# EAGLE design emonDCduo-ESP+RF v0.3 (EAGLE 7.7.0)
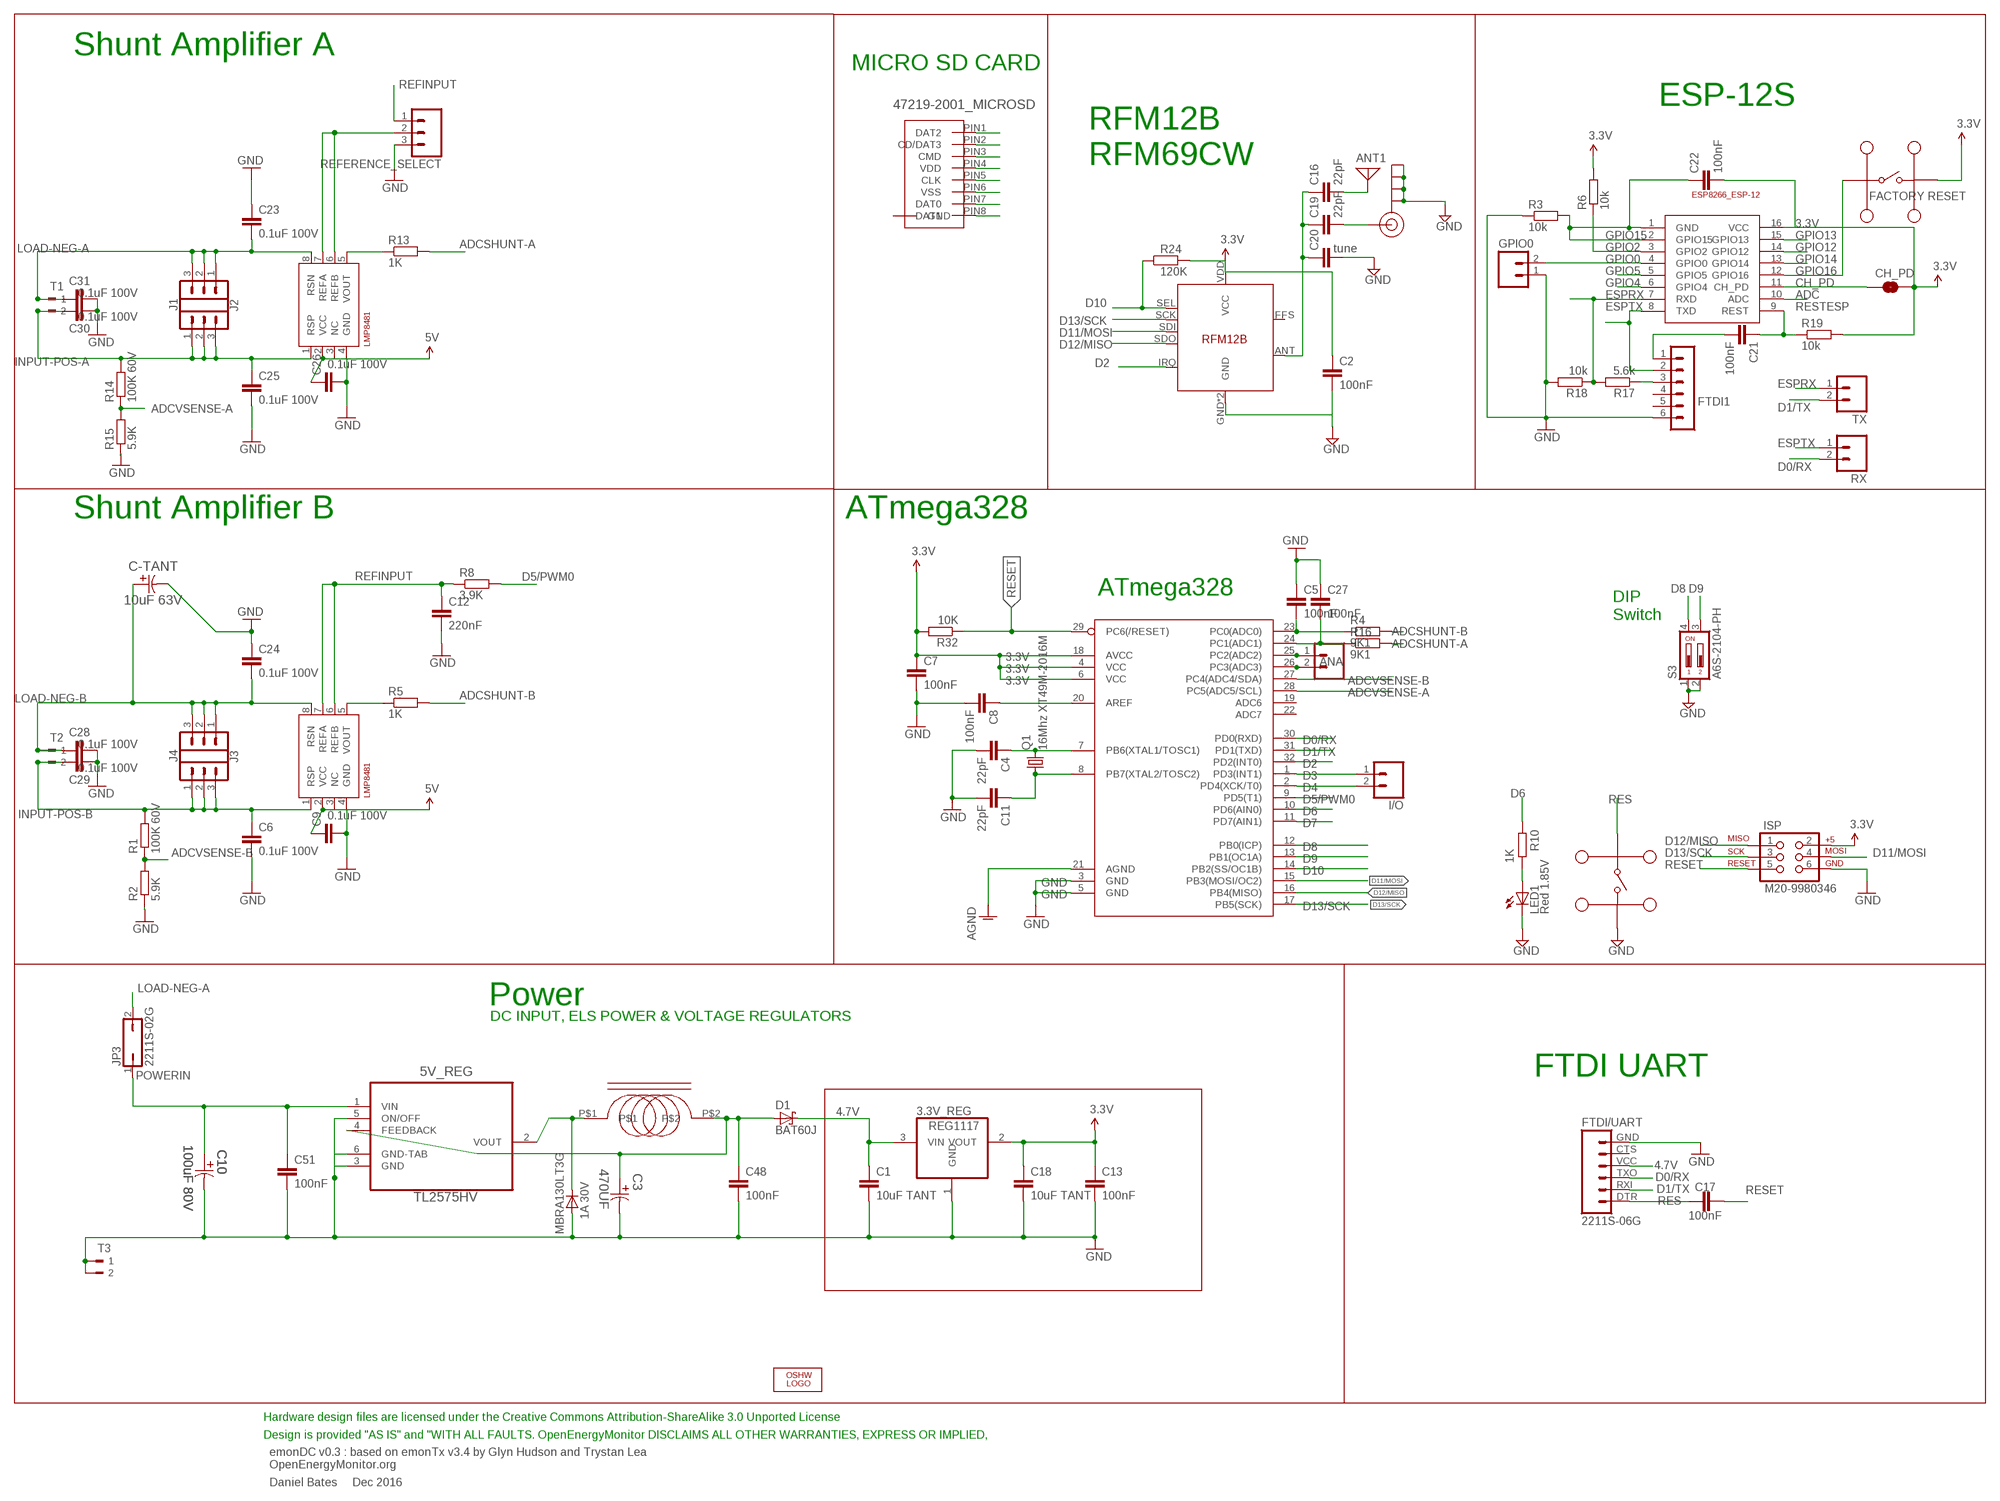
[diagram p0: schematic, sheet 1]

## Parts
3.3V_REG  REG1117  [SOT223]
5V_REG  TL2575HV  TL2575HV-05IKTTR  [TO-263]
ANA  2212S-02SG-85  M02LOCK  [1X02_LOCK]
ANT1  ANTENNA  [PAD-01]
C1  10uF TANT  C-EUC0603  [C0603]
C2  100nF  C-EUC0603  [C0603]
C3  470UF  EEE-FK1C471P-CASE-F  [CAPAE830X1050N]
C4  22pF  C-EUC0603  [C0603]
C5  100nF  C-EUC0603  [C0603]
C6  0.1uF 100V  C-EUC0603  [C0603]
C7  100nF  C-EUC0603  [C0603]
C8  100nF  C-EUC0603  [C0603]
C9  0.1uF 100V  C-EUC0603  [C0603]
C10  100uF 80V  EEV-FK1K101Q-CASE-H13  [CAPAE1350X1400N]
C11  22pF  C-EUC0603  [C0603]
C12  220nF  C-EUC0603  [C0603]
C13  100nF  C-EUC0603  [C0603]
C16  22pF  C-EUC0603  [C0603]
C17  100nF  C-EUC0603  [C0603]
C18  10uF TANT  C-EUC0603  [C0603]
C19  22pF  C-EUC0603  [C0603]
C20  tune  C-EUC0603  [C0603]
C21  100nF  C-EUC0603  [C0603]
C22  100nF  C-EUC0603  [C0603]
C23  0.1uF 100V  C-EUC0603  [C0603]
C24  0.1uF 100V  C-EUC0603  [C0603]
C25  0.1uF 100V  C-EUC0603  [C0603]
C26  0.1uF 100V  C-EUC0603  [C0603]
C27  100nF  C-EUC0603  [C0603]
C28  0.1uF 100V  C-EUC0603  [C0603]
C29  0.1uF 100V  C-EUC0603  [C0603]
C30  0.1uF 100V  C-EUC0603  [C0603]
C31  0.1uF 100V  C-EUC0603  [C0603]
C48  100nF  C-EUC0603  [C0603]
C51  100nF  C-EUC0603  [C0603]
C-TANT  10uF 63V  293D  [2917]
CH_PD  SOLDERJUMPERNO  [SJ_2S-NO]
D1  BAT60J  [SOD323_ST]
D2  MBRA130LT3G  [DO-214]
ESP-12  ESP8266_ESP-12  [ESP8266-ESP12]
FTDI1  FTDI-ESP  MA06-1  [MA06-1]
FTDI/UART  2211S-06G  FTDI_BASICPTH  [FTDI_BASIC]
GPIO0  M02PTH  [1X02]
I1  SRR0603-331KL  [SRR0603-331KL]
I/O  2212S-02SG-85  M02LOCK  [1X02_LOCK]
ISP  M20-9980346  AVR_SPI_PRG_6PTH  [2X3]
J1  CONN_03  [1X03]
J2  CONN_03  [1X03]
J3  CONN_03  [1X03]
J4  CONN_03  [1X03]
J$1  SMA_EDGE  [SMA-EDGE]
JP3  2211S-02G  JP1Q  [JP1]
LED1  Red 1.85V  LEDCHIP-LED0805  [CHIP-LED0805]
LOGO1  OSHW_LOGO_6MILX0200-NT  [OSHW_6X200_NOTEXT]
MC1  MC32882  [SWITCH_TACT_MULTICOMP]
MC32882  MC32882  [SWITCH_TACT_MULTICOMP]
Q1  16Mhz XT49M-2016M  CRYSTALHC49UP  [HC49UP]
R1  100K 60V  R-EU_R0603  [R0603]
R2  5.9K  R-EU_R0603  [R0603]
R3  10k  R-EU_R0603  [R0603]
R4  9K1  R-EU_R0603  [R0603]
R5  1K  R-EU_R0603  [R0603]
R6  10k  R-EU_R0603  [R0603]
R8  3.9K  R-EU_R0603  [R0603]
R10  1K  R-EU_R0603  [R0603]
R13  1K  R-EU_R0603  [R0603]
R14  100K 60V  R-EU_R0603  [R0603]
R15  5.9K  R-EU_R0603  [R0603]
R16  9K1  R-EU_R0603  [R0603]
R17  5.6k  R-EU_R0603  [R0603]
R18  10k  R-EU_R0603  [R0603]
R19  10k  R-EU_R0603  [R0603]
R24  120K  R-EU_R0603  [R0603]
R32  10K  R-EU_R0603  [R0603]
REFERENCE_SELECT  2212S-02SG-85  CONN_03  [1X03]
RF  RFM12B  [RFM12B]
RX  M02PTH  [1X02]
S3  A6S-2104-PH  2_SMT_DIP_SWITCH  [DIP_SWITCH_SMT]
SHUNTMON-A  LMP8481  LMP8481LMP8481-H  [S-PDSO-G08]
SHUNTMON-B  LMP8481  LMP8481LMP8481-H  [S-PDSO-G08]
T1  180-2  [180-2]
T2  180-2  [180-2]
T3  180-2  [180-2]
TX  M02PTH  [1X02]
U1_TQFP  ATMEGA328P  ATMEGA328_SMT  [TQFP32-08]
U$1  47219-2001_MICROSD  [47219-2001_MICROSD]

## Nets
3.3V: 3.3V_REG.2(VOUT) C2.1 C7.1 C13.1 C18.1 C22.2 CH_PD.1 ESP-12.16(VCC) ISP.2 MC1.P$3 MC1.P$4 R6.2 R19.2 R24.2 R32.2 RF.VDD(VCC) U1_TQFP.4(VCC) U1_TQFP.6(VCC) U1_TQFP.18(AVCC) U$1.PIN4(VDD)
4.7V [power]: 3.3V_REG.3(VIN) C1.1 C9.1 C26.1 D1.C FTDI/UART.VCC SHUNTMON-A.2(VCC) SHUNTMON-B.2(VCC) ; supply symbol labelled 5V
5.0V [power]: 5V_REG.4(FEEDBACK) C3.1 C48.1 D1.A I1.P$2
ADC: ESP-12.10(ADC)
ADC2: ANA.1 U1_TQFP.25(PC2(ADC2))
ADC3: ANA.2 U1_TQFP.26(PC3(ADC3))
ADCSHUNT-A: R13.2 R16.2
ADCSHUNT-B: R4.2 R5.2
ADCVSENSE-A: R14.1 R15.2 U1_TQFP.28(PC5(ADC5/SCL))
ADCVSENSE-B: R1.1 R2.2 U1_TQFP.27(PC4(ADC4/SDA))
AGND [thin_power]: U1_TQFP.21(AGND)
CH_PD: CH_PD.2 ESP-12.11(CH_PD)
D0/RX: FTDI/UART.TXO RX.2 U1_TQFP.30(PD0(RXD))
D1/TX: FTDI/UART.RXI TX.2 U1_TQFP.31(PD1(TXD))
D2: RF.IRQ U1_TQFP.32(PD2(INT0))
D3: I/O.1 U1_TQFP.1(PD3(INT1))
D4: I/O.2 U1_TQFP.2(PD4(XCK/T0))
D5/PWM0: R8.2 U1_TQFP.9(PD5(T1))
D6: R10.2 U1_TQFP.10(PD6(AIN0))
D7: U1_TQFP.11(PD7(AIN1))
D8: S3.4 U1_TQFP.12(PB0(ICP))
D9: S3.3 U1_TQFP.13(PB1(OC1A))
D10: R24.1 RF.SEL U1_TQFP.14(PB2(SS/OC1B))
D11/MOSI: ISP.4 RF.SDI U1_TQFP.15(PB3(MOSI/OC2))
D12/MISO: ISP.1 RF.SDO U1_TQFP.16(PB4(MISO))
D13/SCK: ISP.3 RF.SCK U1_TQFP.17(PB5(SCK))
DIG1: C16.1 C19.1 C20.1 RF.ANT
ESPRX: ESP-12.7(RXD) R17.2 R18.1 TX.1
ESPTX: ESP-12.8(TXD) FTDI1.2 RX.1
GND [thin_power]: 3.3V_REG.1(GND) 5V_REG.3(GND) 5V_REG.5(ON/OFF) 5V_REG.6(GND-TAB) C1.2 C2.2 C3.2 C4.2 C5.1 C6.2 C7.2 C8.2 C9.2 C10.2 C11.2 C12.2 C13.2 C18.2 C20.2 C23.1 C24.1 C25.2 C26.2 C27.1 C28.2 C29.2 C30.2 C31.2 C48.2 C51.2 C-TANT.2 D2.P$2(A) FTDI1.6 FTDI/UART.GND GPIO0.1 ISP.6 J$1.GND@0(GND) J$1.GND@1(GND) J$1.GND@2(GND) J$1.GND@3(GND) LED1.C MC32882.P$3 MC32882.P$4 R2.1 R3.1 R15.1 R18.2 REFERENCE_SELECT.3 RF.GND RF.P$12(GND) S3.1 S3.2 SHUNTMON-A.4(GND) SHUNTMON-B.4(GND) T3.1 T3.2 U1_TQFP.3(GND) U1_TQFP.5(GND) U$1.PIN6(VSS)
GPIO0: ESP-12.4(GPIO0) GPIO0.2
GPIO2: ESP-12.3(GPIO2) R6.1 U$1.PIN2(CD/DAT3)
GPIO4: ESP-12.6(GPIO4)
GPIO5: ESP-12.5(GPIO5)
GPIO12: ESP-12.14(GPIO12) U$1.PIN7(DAT0)
GPIO13: ESP-12.15(GPIO13) U$1.PIN3(CMD)
GPIO14: ESP-12.13(GPIO14) U$1.PIN5(CLK)
GPIO15: C22.1 ESP-12.1(GND) ESP-12.2(GPIO15) R3.2
GPIO16: ESP-12.12(GPIO16) MC1.P$1 MC1.P$2
IND: 5V_REG.2(VOUT) D2.P$1(C) I1.P$1
INPUT-POS-A: C25.1 C30.1 J2.1 J2.2 J2.3 R14.2 SHUNTMON-A.1(RSP) T1.2
INPUT-POS-B: C6.1 C29.1 J3.1 J3.2 J3.3 R1.2 SHUNTMON-B.1(RSP) T2.2
LOAD-NEG-A: C23.2 C31.1 J1.1 J1.2 J1.3 JP3.2 SHUNTMON-A.8(RSN) T1.1
LOAD-NEG-B: C24.2 C28.1 C-TANT.1 J4.1 J4.2 J4.3 SHUNTMON-B.8(RSN) T2.1
N$1: C4.1 Q1.2 U1_TQFP.7(PB6(XTAL1/TOSC1))
N$2: C5.2 R4.1 U1_TQFP.23(PC0(ADC0))
N$4: R13.1 SHUNTMON-A.5(VOUT)
N$6: R5.1 SHUNTMON-B.5(VOUT)
N$7: U$1.PIN1(DAT2)
N$9: C11.1 Q1.1 U1_TQFP.8(PB7(XTAL2/TOSC2))
N$11: ANT1.1 C16.2
N$20: C8.1 U1_TQFP.20(AREF)
N$24: C19.2 J$1.SIG(SIGNAL)
N$27: C27.2 R16.1 U1_TQFP.24(PC1(ADC1))
N$28 [thin_power]: REFERENCE_SELECT.2 SHUNTMON-A.6(REFB) SHUNTMON-A.7(REFA)
N$30: C21.2 FTDI1.1
N$32: U$1.PIN8(DAT1)
N$36: FTDI1.3 R17.1
N$41: LED1.A R10.1
POWERIN: 5V_REG.1(VIN) C10.1 C51.1 JP3.1
REFINPUT: C12.1 R8.1 REFERENCE_SELECT.1 SHUNTMON-B.6(REFB) SHUNTMON-B.7(REFA)
RES: C17.1 FTDI/UART.DTR MC32882.P$1 MC32882.P$2
RESET: C17.2 ISP.5 R32.1 U1_TQFP.29(PC6(/RESET))
RESTESP: C21.1 ESP-12.9(REST) R19.1
Unconnected: FTDI1.4 FTDI1.5 FTDI/UART.CTS RF.FFS SHUNTMON-A.3(NC) SHUNTMON-B.3(NC) U1_TQFP.19(ADC6) U1_TQFP.22(ADC7) U$1.P$1(GND) U$1.P$2(GND) U$1.P$3(GND) U$1.P$4(GND)

## Notes on the sheet
- Shunt Amplifier A
- MICRO SD CARD
- ESP-12S
- RFM12B
  RFM69CW
- FACTORY RESET
- Shunt Amplifier B | ATmega328
- ATmega328
- DIP
  Switch
- Power
- DC INPUT, ELS POWER & VOLTAGE REGULATORS
- FTDI UART
- Hardware design files are licensed under the Creative Commons Attribution-ShareAlike 3.0 Unported License
- Design is provided "AS IS" and "WITH ALL FAULTS. OpenEnergyMonitor DISCLAIMS ALL OTHER WARRANTIES, EXPRESS OR IMPLIED,
- emonDC v0.3 : based on emonTx v3.4 by Glyn Hudson and Trystan Lea
  OpenEnergyMonitor.org
- Daniel Bates     Dec 2016

## Library data of the parts
3.3V_REG = burr-brown:REG1117: 800mA and 1A Low Dropout (LDO) Positive Regulator 1.8V, 2.5V, 2.85V, 3.3V, 5V, and Adj; MF: TEXAS INSTRUMENTS; MPN: REG1117; OC_FARNELL: 1097566; OC_NEWARK: 14P6981
5V_REG = TL2575HV:TL2575HV; MF: TEXAS INSTRUMENTS; MPN: LM2575HVS-15/NOPB; OC_FARNELL: 2492609
ANA I/O = SparkFun-Connectors:M02: Standard 2-pin 0.1" header. Use with - straight break away headers ( PRT-00116) - right angle break away headers (PRT-00553) - swiss pins (PRT-00743) - machine pins (PRT-00117) - female headers (PRT-00115) Molex polarized connector foot print use with: PRT-08233 with associated crimp pins and housings. 2.54_SCREWTERM for use with PRT-10571. 3.5mm Screw Terminal footprints for PRT-08084 5mm Screw Terminal footprints for use with PRT-08432; MF: MULTICOMP; MPN: 2212S-02SG-85; OC_FARNELL: 1593458
ANT1 = discrete:ANTENNA: Antenna; OC_FARNELL: unknown
C1 C2 C4 C5 C7 C8 C11-C13 C16-C22 C27 C48 C51 = rcl:C-EU: CAPACITOR, European symbol
C3 = Panasonic-EEEFK_EEEFP:EEE-: Aluminum Electrolytic Capacitors,Surface Mount Type; MPN: EEE-FK1C471P; OC_FARNELL: 9695710; OC_NEWARK: 96K9385; PACKAGE: CASE-F; SUPPLIER: PANASONIC; TOLERANCE: ±20 %; VOLTAGERATING: 16V
C6 C9 C23-C26 C28-C31 = rcl:C-EU: CAPACITOR, European symbol; MPN: C1608X7S2A104K080AB
C10 = Panasonic-EEE-EEV-EEF-ECQ:EEV-: Aluminum Electrolytic Capacitors,Surface Mount Type; MPN: EEVFK1K101Q; OC_FARNELL: 9696113; OC_NEWARK: 96K9484; SUPPLIER: PANASONIC; TOLERANCE: ±20 %; VALUE: 100UF; VOLTAGERATING: 80V
C-TANT = 2917 footprint capacitor:293D; PARTNO: 293D106X0063E2TE3; SIZE: 2917
CH_PD = SparkFun:SOLDERJUMPER: Solder Jumper Standard SMD solder jumper. Used to automate production. Two varients : Normally Open and Normally Closed are the same, but have different paste layers. NC will have a large amount of paste and should jumper during reflow.
D1 = diode:BAT60J: Schottky barrier diode Source: www.st.com, BAT60J.pdf
D2 = CASE 403D Diode:MBRA130LT3G: Fast switching diode; MF: ON SEMICONDUCTOR; MPN: MBRA130LT3G; OC_FARNELL: 9555978
ESP-12 = ESP8266-ESP12:ESP8266_ESP-12
FTDI1 = JeeLabs:MA06-1: PIN HEADER
FTDI/UART = SparkFun:FTDI_BASIC: FTDI Basic: 3.3V and 5V; MF: MULTICOMP; MPN: 2211S-06G; OC_FARNELL: 1593415
GPIO0 RX TX = SparkFun:M02: Header 2 Standard 2-pin 0.1" header. Use with straight break away headers (SKU : PRT-00116), right angle break away headers (PRT-00553), swiss pins (PRT-00743), machine pins (PRT-00117), and female headers (PRT-00115). Molex polarized connector foot print use with SKU : PRT-08233 with associated crimp pins and housings.
I1 = SRR0603-331KL:SRR0603-331KL: SRR0603-331KL; INDUCTANCE: 330uH; MF: BOURNS; MPN: SRR0603-331KL; OC_FARNELL: 2333890
ISP = SparkFun:AVR_SPI_PRG_6: AVR ISP 6 Pin This is the reduced ISP connector for AVR programming. Common on Arduino. This footprint will take up less PCB space and can be used with a 10-pin to 6-pin adapter such as SKU: BOB-08508; MF: HARWIN; MPN: M20-9980346; OC_FARNELL: 1022231
J1-J4 = SparkFun-Connectors:CONN_03: Multi connection point. Often used as Generic Header-pin footprint for 0.1 inch spaced/style header connections On any of the 0.1 inch spaced packages, you can populate with these: Break Away Headers - Straight <https://www.sparkfun.com/products/116> (PRT-00116) Break Away Male Headers - Right Angle <https://www.sparkfun.com/products/553> (PRT-00553) Female Headers <https://www.sparkfun.com/products/115> (PRT-00115) Break Away Headers - Machine Pin <https://www.sparkfun.com/products/117> (PRT-00117) Break Away Female Headers - Swiss Machine Pin <https://www.sparkfun.com/products/743> (PRT-00743) Stackable Header - 3 Pin (Female, 0.1") <https://www.sparkfun.com/products/13875> (PRT-13875) For SCREWTERMINALS and SPRING TERMINALS visit here: Screw Terimnals on SparkFun.com <https://www.sparkfun.com/search/results?term=Screw+Terminals> (5mm/3.5mm/2.54mm spacing) This device is also useful as a general connection point to wire up your design to another part of your project. Our various solder wires solder well into these plated through hole pads. Hook-Up Wire - Assortment (Stranded, 22 AWG) <https://www.sparkfun.com/products/11375> (PRT-11375) Hook-Up Wire - Assortment (Solid Core, 22 AWG) <https://www.sparkfun.com/products/11367> (PRT-11367) View the entire wire category on our website here <https://www.sparkfun.com/categories/141> Special notes: Molex polarized connector foot print use with SKU : PRT-08232 with associated crimp pins and housings.
J$1 = SparkFun-Connectors:SMA_EDGE: SMA Antenna Connector End launch SMA connector. The paste layer has been removed so that the connector can be hand soldered onto the board after reflow.; OC_FARNELL: unknown
JP3 = jumper:JP1Q: JUMPER; MF: MULTICOMP; MPN: 2211S-02G; OC_FARNELL: 1593411
LED1 = adafruit:LED: LED OSRAM: - CHIPLED LG R971, LG N971, LY N971, LG Q971, LY Q971, LO R971, LY R971 LH N974, LH R974 LS Q976, LO Q976, LY Q976 LO Q996 - Hyper CHIPLED LW Q18S LB Q993, LB Q99A, LB R99A - SideLED LS A670, LO A670, LY A670, LG A670, LP A670 LB A673, LV A673, LT A673, LW A673 LH A674 LY A675 LS A676, LA A676, LO A676, LY A676, LW A676 LS A679, LY A679, LG A679 - Hyper Micro SIDELED® LS Y876, LA Y876, LO Y876, LY Y876 LT Y87S - SmartLED LW L88C, LW L88S LB L89C, LB L89S, LG L890 LS L89K, LO L89K, LY L89K LS L896, LA L896, LO L896, LY L896 - TOPLED LS T670, LO T670, LY T670, LG T670, LP T670 LSG T670, LSP T670, LSY T670, LOP T670, LYG T670 LG T671, LOG T671, LSG T671 LB T673, LV T673, LT T673, LW T673 LH T674 LS T676, LA T676, LO T676, LY T676, LB T676, LH T676, LSB T676, LW T676 LB T67C, LV T67C, LT T67C, LS T67K, LO T67K, LY T67K, LW E67C LS E67B, LA E67B, LO E67B, LY E67B, LB E67C, LV E67C, LT E67C LW T67C LS T679, LY T679, LG T679 LS T770, LO T770, LY T770, LG T770, LP T770 LB T773, LV T773, LT T773, LW T773 LH T774 LS E675, LA E675, LY E675, LS T675 LS T776, LA T776, LO T776, LY T776, LB T776 LHGB T686 LT T68C, LB T68C - Hyper Mini TOPLED® LB M676 - Mini TOPLED Santana® LG M470 LS M47K, LO M47K, LY M47K Source: http://www.osram.convergy.de/; MF: ROHM; MPN: SML-211UTT86K; OC_FARNELL: 1685056
LOGO1 = ohw-logo:OSHW_LOGO_6MIL; OC_FARNELL: unknown
MC1 MC32882 = multicomp tact switch:MC32882
Q1 = adafruit:CRYSTAL: CRYSTAL; MF: VISHAY; MPN: XT49M-2016M; OC_FARNELL: 1469641; OC_NEWARK: unknown
R1 R14 = rcl:R-EU_: RESISTOR, European symbol; MPN: MCWR06X1003FTL
R2 R15 = rcl:R-EU_: RESISTOR, European symbol; MPN: MCWR06X5901FTL
R3-R6 R8 R10 R13 R16-R19 R24 R32 = rcl:R-EU_: RESISTOR, European symbol
REFERENCE_SELECT = SparkFun-Connectors:CONN_03: Multi connection point. Often used as Generic Header-pin footprint for 0.1 inch spaced/style header connections On any of the 0.1 inch spaced packages, you can populate with these: Break Away Headers - Straight <https://www.sparkfun.com/products/116> (PRT-00116) Break Away Male Headers - Right Angle <https://www.sparkfun.com/products/553> (PRT-00553) Female Headers <https://www.sparkfun.com/products/115> (PRT-00115) Break Away Headers - Machine Pin <https://www.sparkfun.com/products/117> (PRT-00117) Break Away Female Headers - Swiss Machine Pin <https://www.sparkfun.com/products/743> (PRT-00743) Stackable Header - 3 Pin (Female, 0.1") <https://www.sparkfun.com/products/13875> (PRT-13875) For SCREWTERMINALS and SPRING TERMINALS visit here: Screw Terimnals on SparkFun.com <https://www.sparkfun.com/search/results?term=Screw+Terminals> (5mm/3.5mm/2.54mm spacing) This device is also useful as a general connection point to wire up your design to another part of your project. Our various solder wires solder well into these plated through hole pads. Hook-Up Wire - Assortment (Stranded, 22 AWG) <https://www.sparkfun.com/products/11375> (PRT-11375) Hook-Up Wire - Assortment (Solid Core, 22 AWG) <https://www.sparkfun.com/products/11367> (PRT-11367) View the entire wire category on our website here <https://www.sparkfun.com/categories/141> Special notes: Molex polarized connector foot print use with SKU : PRT-08232 with associated crimp pins and housings.; MF: MULTICOMP; MPN: 2212S-02SG-85; OC_FARNELL: 1593458
RF = JeeParts:RFM12B; OC_FARNELL: unknown
S3 = OpenEnergyMonitor:2_SMT_DIP_SWITCH: Multicomp MCEMR-02-T 2 throw SMT DIP switch, Farnell 1524005; MF: OMRON ELECTRONIC COMPONENTS; MPN: A6S2104H; OC_FARNELL: 1960894
SHUNTMON-A = lmp8481b:LMP8481: LMP8481MM-H/NOPB 100V/V; MF: TEXAS INSTRUMENTS; MPN: LMP8481MME-S/NOPB; OC_FARNELL: 2322044
SHUNTMON-B = lmp8481b:LMP8481: LMP8481MM-H/NOPB 100V/V; MF: TEXAS INSTRUMENTS; MPN: LMP8481MME-H/NOPB; OC_FARNELL: 2322044
T1-T3 = con-weidmueller-sl35:180-2: WEIDMUELLER CLAMP CONNECTOR; OC_FARNELL: unknown; OC_NEWARK: unknown
U1_TQFP = SparkFun-DigitalIC:ATMEGA328_SMT: 32-Pin Atmega328 part Commonly used on Arduino compatible boards Available in QFP and QFN packages TQFP is IC-09069 QFN is non-stock; MF: ATMEL; MPN: ATMEGA328P-AU; OC_FARNELL: 1972086; PROD_ID: IC-09069
U$1 = 47219-2001_SD_MICRO:47219-2001_MICROSD

## Net classes
2 thin_power: width 0.254 mm

## Board
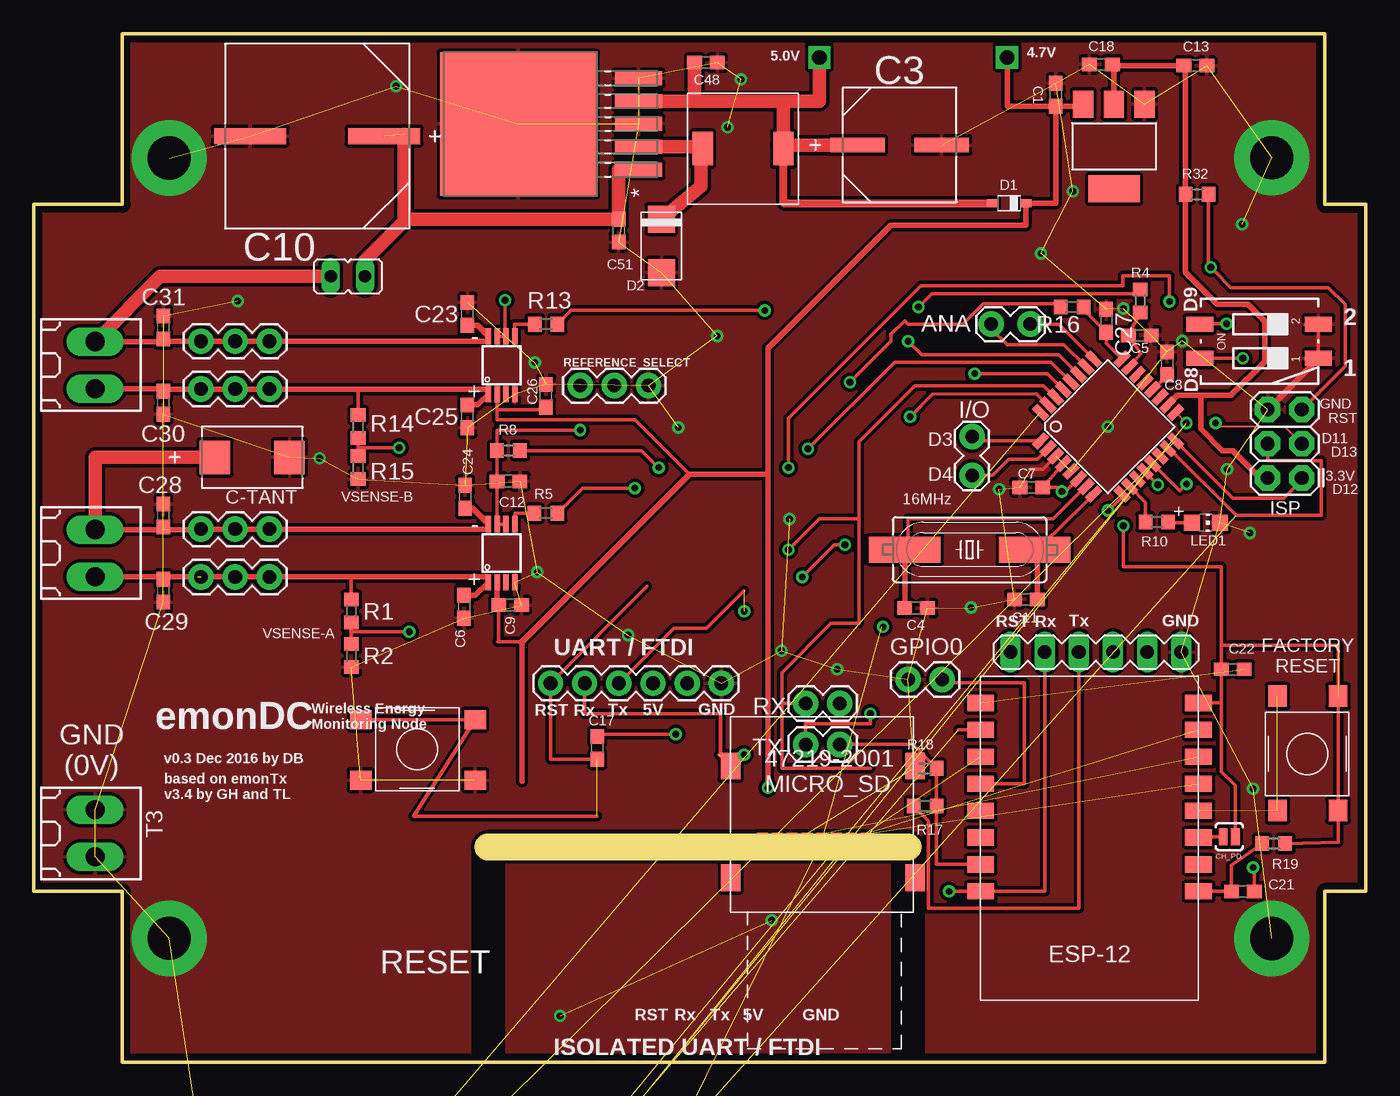
[diagram p1: board, top side]
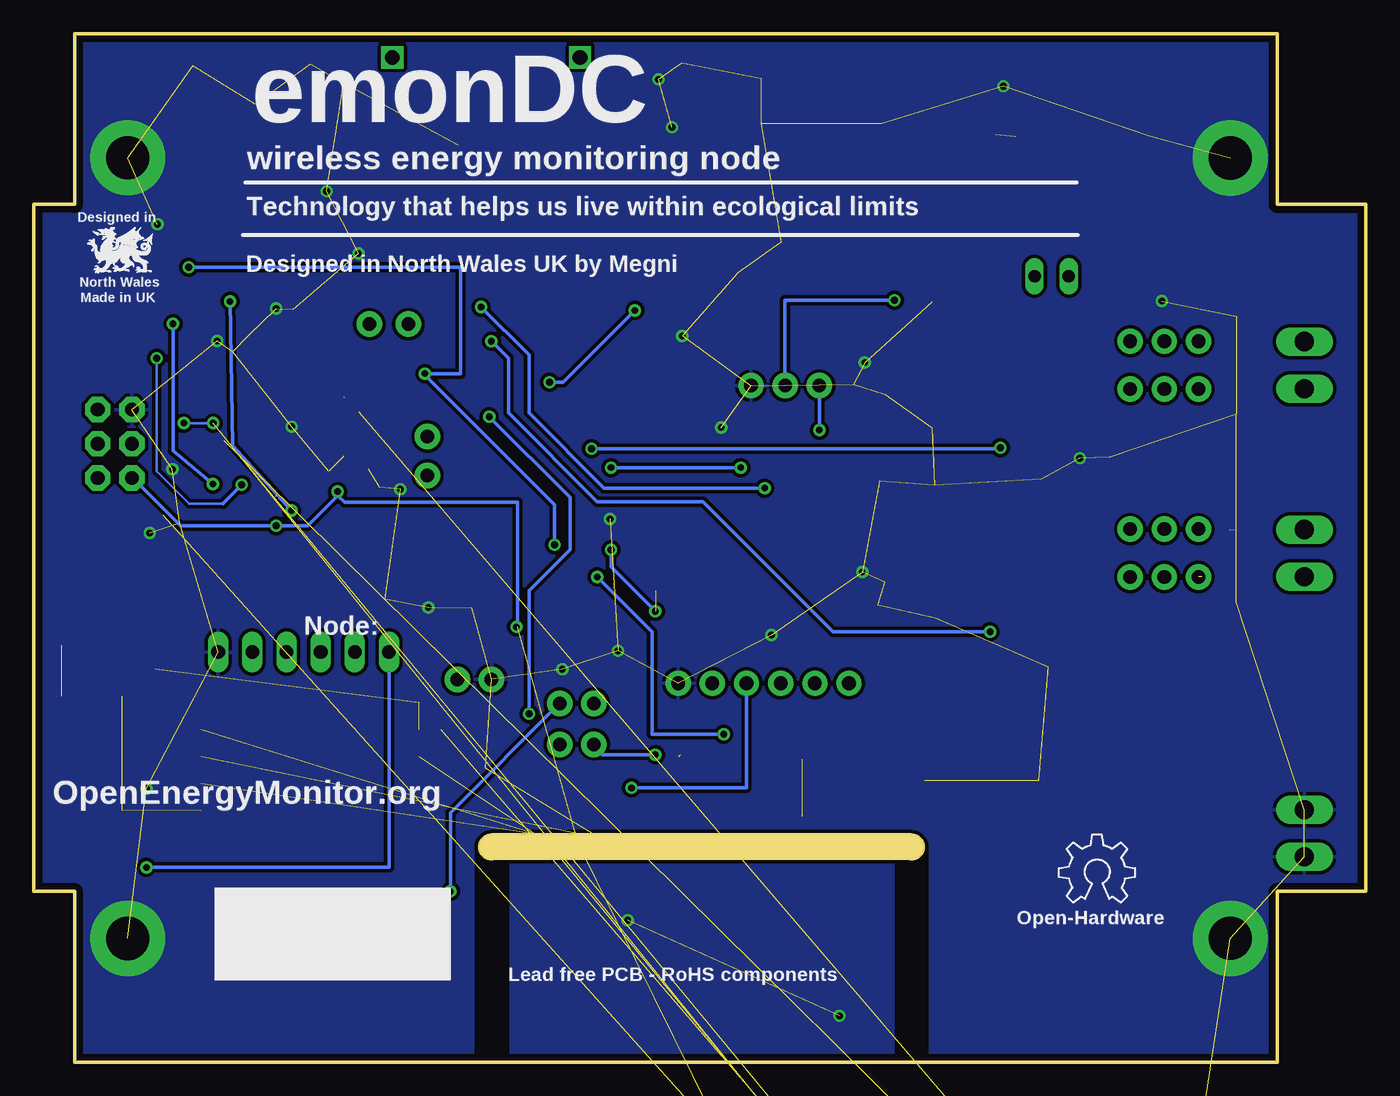
[diagram p2: board, bottom side, seen from below]

Size 99.06 x 76.45 mm. Coordinates in mm from the lower left corner, seen from the top.
Outline: 6.6,63.75 6.6,76.45 96.01,76.45 96.01,63.75 99.06,63.75 99.06,12.7 96.01,12.7 96.01,0 6.6,0 6.6,12.7 0,12.7 0,63.75 6.6,63.75
Copper layers (1*16): Top 0.0178mm / dielectric 59mil / Bottom 0.0178mm
Design rules "SSC-EAGLE-2Lyr_v1.0.0.3": minimum track width 6mil, minimum drill 14mil, track to track 6mil, track to pad 6mil, pad to pad 6mil, via to via 6mil, smd to smd 6mil, copper to edge 20mil, drill to drill 16mil, minimum pad ring 8mil, minimum via ring 8mil, stop-mask expansion 3mil, vias tented up to drill 0mil, thermal gap 10mil
tRestrict: 3 lines
bRestrict: 3 lines
Milling: 1 lines

### Footprints (pad centres in the part's own frame; a part is rotated, then mirrored left to right if it is on the bottom)
SOT223 = smd 1.499 x 2.007: 1 -2.261,-3.15; 2 0.025,-3.15; 3 2.311,-3.15 | smd 3.81 x 2.007: 4 0,3.15
TO-263 = smd 1.041 x 3.505: 1 -3.404,-8.788; 2 -1.702,-8.788; 3 0,-8.788; 4 1.702,-8.788; 5 3.404,-8.788 | smd 10.668 x 11.659: 6 0,0.152
1X02_LOCK = drill 1.016 pad 1.88: 1 -0.178,0; 2 2.718,0
PAD-01 = drill 1.321 pad 2.54 octagon: 1 0,0
C0603 = smd 1.1 x 1: 1 -0.85,0; 2 0.85,0
CAPAE830X1050N = smd 4.064 x 1.092: 1 -3.124,0; 2 3.124,0
CAPAE1350X1400N = smd 5.359 x 1.194: 1 -4.978,0; 2 4.978,0
2917 = smd 2.261 x 2.489: 1 -2.769,0; 2 2.769,0
SJ_2S-NO = smd 0.635 x 1.27: 1 -0.45,0; 2 0.45,0
SOD323_ST = smd 0.8 x 0.6: A 1.25,0; C -1.25,0
DO-214 = smd 2 x 2: P$1 -2,0; P$2 2,0
ESP8266-ESP12 = smd 2 x 1.2: 1 16.2,2; 2 16.2,4; 3 16.2,6; 4 16.2,8; 5 16.2,10; 6 16.2,12; 7 16.2,14; 8 16.2,16; 9 0,16; 10 0,14; 11 0,12; 12 0,10; 13 0,8; 14 0,6; 15 0,4; 16 0,2
MA06-1 = drill 1.016 long: 1 0,0; 2 2.54,0; 3 5.08,0; 4 7.62,0; 5 10.16,0; 6 12.7,0
FTDI_BASIC = drill 1.016 pad 1.88: CTS 10.16,0; DTR 0,0; GND 12.7,0; RXI 2.54,0; TXO 5.08,0; VCC 7.62,0
1X02 = drill 1.016 pad 1.88: 1 0,0; 2 2.54,0
SRR0603-331KL = smd 1.5 x 2.5: P$1 -3,0; P$2 3,0
2X3 = drill 1.016 pad 1.88 octagon: 1 0,0; 2 0,2.54; 3 2.54,0; 4 2.54,2.54; 5 5.08,0; 6 5.08,2.54
1X03 = drill 1.016 pad 1.88: 1 0,0; 2 2.54,0; 3 5.08,0
SMA-EDGE = smd 1.524 x 4.064: GND@0 0,0; GND@1 5.08,0; SIG 2.54,0 | smd 1.524 x 4.064 bottom: GND@2 0,0; GND@3 5.08,0
JP1 = drill 0.914 long: 1 0,-1.27; 2 0,1.27
CHIP-LED0805 = smd 1.2 x 1.2: A 0,-1.05; C 0,1.05
SWITCH_TACT_MULTICOMP = smd 1.6 x 1.4: P$1 -1.1,5.3; P$2 7.4,5.3; P$3 -1.1,0.8; P$4 7.4,0.8
HC49UP = smd 5.334 x 1.93: 1 -4.826,0; 2 4.826,0
R0603 = smd 1 x 1.1: 1 -0.85,0; 2 0.85,0
RFM12B = smd 2.54 x 1.27: ANT 8,-6; FFS -8,2; GND 8,-2; IRQ -8,4; P$8 -8,0; P$9 -8,-2; P$10 -8,-4; P$12 -8,-6; P$16 8,0; SCK 8,4; SDI 8,2; SDO -8,6; SEL 8,6; VDD 8,-4
DIP_SWITCH_SMT = smd 1.1 x 2: 1 -1.27,-4.215; 2 1.27,-4.215; 3 1.27,4.615; 4 -1.27,4.615
S-PDSO-G08 = smd 0.4 x 1.2: 1 -0.975,-2.157; 2 -0.325,-2.157; 3 0.325,-2.157; 4 0.975,-2.157; 5 0.975,2.157; 6 0.325,2.157; 7 -0.325,2.157; 8 -0.975,2.157
180-2 = drill 1.422 long: 1 -1.75,0; 2 1.75,0
TQFP32-08 = smd 1.27 x 0.559: 1 -4.293,2.8; 2 -4.293,2; 3 -4.293,1.2; 4 -4.293,0.4; 5 -4.293,-0.4; 6 -4.293,-1.2; 7 -4.293,-2; 8 -4.293,-2.8; 17 4.293,-2.8; 18 4.293,-2; 19 4.293,-1.2; 20 4.293,-0.4; 21 4.293,0.4; 22 4.293,1.2; 23 4.293,2; 24 4.293,2.8 | smd 0.559 x 1.27: 9 -2.8,-4.293; 10 -2,-4.293; 11 -1.2,-4.293; 12 -0.4,-4.293; 13 0.4,-4.293; 14 1.2,-4.293; 15 2,-4.293; 16 2.8,-4.293; 25 2.8,4.293; 26 2,4.293; 27 1.2,4.293; 28 0.4,4.293; 29 -0.4,4.293; 30 -1.2,4.293; 31 -2,4.293; 32 -2.8,4.293
47219-2001_MICROSD = smd 1.45 x 2: P$1 0,0; P$2 13.75,0; P$3 0,8.3; P$4 13.75,8.3 | smd 0.8 x 1.5: PIN1 10.08,2.6; PIN2 8.98,2.6; PIN3 7.88,2.6; PIN4 6.78,2.6; PIN5 5.68,2.6; PIN6 4.58,2.6; PIN7 3.48,2.6; PIN8 2.38,2.6

### Placement (x,y rotation side)
3.3V_REG  80.34,68.07 180 top
5V_REG  36.19,69.74 90 top
ANA  73.91,54.86 180 top
ANT1  5.59,-26.67 0 top  (outside the outline)
C1  76,71.91 90 top
C2  -4.57,-55.88 0 top  (outside the outline)
C3  64.39,68.17 0 top
C4  65.62,33.76 0 top
C5  82.24,54.03 180 top
C6  32,33.86 270 top
C7  74.18,42.73 180 top
C8  84.28,51.94 90 top
C9  35.43,33.99 0 top
C10  21.08,68.83 180 top
C11  73.79,34.4 180 top
C12  35.31,43.18 0 top
C13  86.38,74.08 0 top
C16  3.3,-55.88 0 top  (outside the outline)
C17  41.91,23.37 90 top
C18  79.35,74.17 180 top
C19  10.16,-55.88 0 top  (outside the outline)
C20  17.02,-55.88 0 top  (outside the outline)
C21  89.92,12.7 0 top
C22  89.15,29.21 180 top
C23  32.26,55.63 270 top
C24  32.08,42.04 270 top
C25  32.26,48.01 270 top
C26  38.1,49.53 90 top
C27  79.76,55.12 270 top
C28  9.65,40.64 90 top
C29  9.65,35.05 270 top
C30  9.65,49.02 270 top
C31  9.65,54.61 90 top
C48  49.99,74.3 0 top
C51  43.5,61.81 270 top
C-TANT  16.26,44.96 0 top
CH_PD  88.9,16.76 180 top
D1  72.53,63.85 180 top
D2  46.68,60.67 270 top
ESP-12  86.61,28.7 180 top
FTDI1  72.64,30.48 0 top
FTDI/UART  38.43,28.17 0 top
GPIO0  65.02,28.45 0 top
I1  52.76,67.91 0 top
I/O  69.78,46.33 270 top
ISP  94.3,43.43 90 top
J1  12.45,53.59 0 top
J2  12.45,50.04 0 top
J3  12.45,36.07 0 top
J4  12.45,39.62 0 top
J$1  18.54,-46.23 0 top  (outside the outline)
JP3  23.37,58.42 90 top
LED1  87.16,40.11 270 top
LOGO1  22.83,11.86 0 bottom
MC1  97.79,19.81 90 top
MC32882  25.43,20.17 0 top
Q1  69.6,38.1 180 top
R1  23.62,33.53 90 top
R2  23.62,30.23 90 top
R3  -5.59,-60.71 0 top  (outside the outline)
R4  82.28,56.59 90 top
R5  38.09,40.81 0 top
R6  -5.59,-65.53 0 top  (outside the outline)
R8  35.31,45.47 0 top
R10  83.52,40.16 180 top
R13  38.1,54.86 0 top
R14  24.13,47.24 90 top
R15  24.13,44.2 90 top
R16  77.22,56.13 180 top
R17  66.29,19.05 0 top
R18  66.29,21.84 180 top
R19  92.2,16.26 0 top
R24  22.1,-55.88 0 top  (outside the outline)
R32  86.5,64.51 180 top
REFERENCE_SELECT  40.64,50.29 0 top
RF  5.08,-46.48 0 top  (outside the outline)
RX  59.94,26.67 180 top
S3  91.31,53.59 90 top
SHUNTMON-A  34.8,51.82 0 top
SHUNTMON-B  34.8,37.85 0 top
T1  4.57,51.82 270 top
T2  4.57,37.85 270 top
T3  4.57,17.02 270 top
TX  59.94,23.62 180 top
U1_TQFP  79.88,47.24 45 top
U$1  51.82,13.72 0 top

### Tracks (layer width: path | path; a pad name or v marks a point on that pad's centre or on a via)
3.3V  (via drill 0.5)  (6 unrouted)
  Top 0.203: U1_TQFP.4 76.62,44.49 76.68,44.53 76.73,44.65 | 84.29,48.82 U1_TQFP.18 | 77.72,43.34 U1_TQFP.6
  Top 0.254: U1_TQFP.4 C7.1 76.14,42.73 v76.45,42.42 76.71,42.42 77.7,43.41 | 85.03,49.58 85.03,49.56 | R19.2 96.99,16.34 MC1.P$3 96.99,30.99 88.3,30.99 | ESP-12.16 88.3,26.7 | 88.3,26.7 C22.2 88.3,30.99 | 88.3,26.7 88.3,21.59 89.35,20.57 CH_PD.1 | 88.3,30.99 88.3,36.83 81.03,36.83 v81.03,39.88
  Top 0.406: 77.7,43.41 U1_TQFP.6 | 86.77,49.58 89.03,49.58 91.53,52.08 91.53,55.08 90.28,56.33 88.03,56.33 85.65,58.71 R32.2 85.65,73.96 C13.1 80.74,74.08 80.32,73.66 | 86.77,49.58 85.03,49.58 | 85.03,49.56 U1_TQFP.18 | 86.77,49.58 86.77,47.08 88.39,45.47 89.15,45.47 91.19,43.43 ISP.2 | 3.3V_REG.2 80.32,73.66 | 80.32,73.66 80.32,74.05 C18.1
  Bottom 0.203: 91.82,43.37 ISP.2
  Bottom 0.254: v63.16,32.36 63.08,32.36 63.08,41.61 75.94,41.61 76.45,42.12 | ISP.2 91.69,43.43 88.14,39.88 v81.03,39.88 78.69,39.88 76.45,42.12 | 76.45,42.12 v76.45,42.42
4.7V  (via drill 0.5, 1.1)
  Top 0.254: 54.61,43.69 54.61,39.46 | 36.32,31.24 34.58,31.24 | SHUNTMON-A.2 34.47,48.51 | 34.47,48.51 34.47,47.75 44.7,47.75 48.77,43.69 | C9.1 34.58,31.24 | 34.58,31.24 34.51,31.24 | C26.1 38.1,48.51 34.47,48.51
  Top 0.406: C1.1 76,63.85 D1.C 73.78,62.23 63.75,62.23 54.61,53.09 54.61,43.69 | C1.1 78.03,71.06 3.3V_REG.3 | v72.39,74.68 72.39,71.06 C1.1 | 54.61,43.69 v54.61,20.39 | 36.32,20.9 36.32,31.24 48.77,43.69 54.61,43.69 | SHUNTMON-B.2 34.47,34.09 C9.1
  Bottom 0.254: FTDI/UART.VCC 46.05,20.39 v54.61,20.39
5.0V  (via drill 1.1)
  Top 0.61: D1.A 55.76,63.85 I1.P$2
  Top 1.016: 5V_REG.4 49.14,71.44 | 49.14,71.44 C48.1 | 55.76,71.44 I1.P$2 55.5,68.17 C3.1 | 55.76,71.44 49.14,71.44 | v58.42,74.68 58.42,71.44 55.76,71.44
ADC2
  Top 0.254: U1_TQFP.25 76.22,54.86 ANA.1
ADC3
  Top 0.254: U1_TQFP.26 76.61,53.34 72.39,53.34 71.2,54.53 ANA.2
ADCSHUNT-A  (via drill 0.5)
  Top 0.254: R13.2 39.97,55.88 v54.36,55.88 | v60.71,50.55 63.75,53.59 63.75,54.1 64.77,55.12 65.02,54.86 69.09,54.86 70.61,56.39 76.11,56.39 arc-90 R16.2
  Bottom 0.254: v54.36,55.88 59.69,50.55 v60.71,50.55
ADCSHUNT-B  (via drill 0.5)
  Top 0.254: R4.2 82.18,57.44 81.86,57.12 66.78,57.12 v65.79,56.13 | R5.2 40.8,42.67 v44.7,42.67
  Bottom 0.254: v65.79,56.13 62.23,52.58 62.23,48.26 56.64,42.67 51.82,42.67 51.05,42.67 v44.7,42.67
ADCVSENSE-A  (via drill 0.5)
  Top 0.254: v57.58,45.59 64.03,52.05 75.65,52.05 U1_TQFP.28 | v27.18,45.67 24.18,45.67 arc-90 24.13,45.72 | R14.1 24.13,45.72 | 24.13,45.72 R15.2
  Bottom 0.254: v57.58,45.59 27.25,45.59 v27.18,45.67
ADCVSENSE-B  (via drill 0.5)
  Top 0.254: R2.2 R1.1 23.62,32 v27.94,32 | U1_TQFP.27 76.25,52.58 70.61,52.58 70.36,52.58 66.04,52.58 v65.02,53.59
  Bottom 0.254: v27.94,32 39.62,32 49.28,41.66 57.15,41.66 63.75,48.26 63.75,52.32 v65.02,53.59
CH_PD
  Top 0.254: ESP-12.11 86.61,16.76 CH_PD.2
D0/RX  (via drill 0.5)  (2 unrouted)
  Top 0.203: 76,49.35 75.95,49.4
  Top 0.254: 75.95,49.4 75.06,50.28 65.53,50.28 61.38,46.13 61.38,40.39 | 61.38,40.39 61.38,32.63 59.3,32.63 55.63,28.96 55.63,26.67 | 62.23,21.84 55.63,21.84 55.63,26.67 | RX.2 55.63,26.67 | 52.83,35.05 50.04,32.26 47.6,32.26 FTDI/UART.TXO | v56.13,38.1 58.42,40.39 61.38,40.39
  Bottom 0.254: v52.83,33.53 56.13,36.83 v56.13,38.1
D1/TX  (via drill 0.5)  (1 unrouted)
  Top 0.254: v65.18,47.98 66.83,49.63 74.58,49.68 75.35,48.91 U1_TQFP.31 | FTDI/UART.RXI 40.97,25.91 51.05,25.91 51.05,22.74 | 50.98,22.86 v52.83,22.86 | v62.23,25.91 62.23,25.15 57.4,25.15 TX.2
  Bottom 0.254: v65.18,47.98 59.18,41.98 59.18,39.57 59.18,39.56 59.18,38.1 62.23,35.05 v62.23,25.91 | v52.83,22.86 56.64,22.86 arc90 TX.2
D2  (1 unrouted)
D3
  Top 0.254: U1_TQFP.1 70.1,46.19 I/O.1
D4
  Top 0.203: U1_TQFP.2 75.43,45.66 75.44,45.67
  Top 0.254: U1_TQFP.2 74.64,44.83 72.53,44.83 71.31,43.62 I/O.2
D5/PWM0  (via drill 0.5)  (1 unrouted)
  Top 0.203: 80.81,42.38 U1_TQFP.9
  Top 0.254: v79.88,41 81.03,42.08 | v84.46,56.55 v84.45,56.55 84.45,58.47 80.98,58.47 80.98,57.73 65.99,57.73 56.13,47.88 v56.13,44.2 | R8.2 45.21,45.47 v46.48,44.2
  Bottom 0.254: v79.88,41 84.28,45.83 v84.46,56.55 | v46.48,44.2 v56.13,44.2
D6
  Top 0.254: U1_TQFP.10 82.67,41.63 R10.2
D7
  Top 0.203: U1_TQFP.11 82.07,43.41 82.02,43.41
D8  (via drill 0.5)
  Top 0.203: U1_TQFP.12 82.63,43.98 82.6,43.97
  Top 0.254: S3.4 v89.92,52.32 | U1_TQFP.12 82.63,43.88 v83.59,42.93
  Bottom 0.203: v89.92,52.32 89.92,43.94 87.5,41.53 84.96,41.53
  Bottom 0.254: v83.59,42.93 84.96,41.55 84.96,41.53
D9  (via drill 0.5)
  Top 0.203: U1_TQFP.13 83.2,44.56 83.18,44.48
  Top 0.254: S3.3 86.72,54.89 v88.7,54.89 | v85.72,42.98 85.22,42.47 U1_TQFP.13
  Bottom 0.254: v85.72,42.98 88.7,45.44 v88.7,54.89
D10  (2 unrouted)
  Top 0.203: U1_TQFP.14 83.72,45.06 83.74,45.16
D11/MOSI  (1 unrouted)
  Top 0.203: U1_TQFP.15 84.3,45.62 84.28,45.7
  Top 0.254: ISP.4 91.76,44.7 95.76,44.7 95.76,40.64 89.41,40.64 84.42,45.62 U1_TQFP.15
D12/MISO  (1 unrouted)
  Top 0.203: 84.85,46.26 U1_TQFP.16
  Top 0.254: U1_TQFP.16 89.18,41.91 92.96,41.91 94.3,43.24 ISP.1
D13/SCK  (via drill 0.5)  (1 unrouted)
  Top 0.203: v85.7,47.51 84.92,48.3 U1_TQFP.17 84.85,48.2 | v87.89,47.51 88,47.25 87.95,47.25 93.03,47.24 ISP.3
  Bottom 0.203: v85.7,47.51 v87.89,47.51
DIG1  (3 unrouted)
ESPRX
  Top 0.254: ESP-12.7 67.14,14.7 R17.2 R18.1 65.37,23.62 TX.1
ESPTX  (via drill 0.5)
  Top 0.254: v68.07,12.7 ESP-12.8 75.18,12.7 FTDI1.2
  Bottom 0.254: v68.07,12.7 68.07,18.54 RX.1
GND  (via drill 0.5, 3.2 pad 5.59)  (84 unrouted)
  Top 0.254: 74.15,44.08 75.03,44.08 U1_TQFP.3 | S3.1 S3.2
  Top 0.406: S3.1 95.53,52.28 ISP.6
  other vias: 79.88,47.24 59.75,29.21 10.08,67.21 50.83,53.99 77.27,64.74 85.42,53.61 71.78,42.59 69.71,33.79 74.91,60.12 92.07,67.23 52.6,73.05 44.2,31.75 90.44,39.34 88.75,44.07 89.85,62.28 10.08,9.2 92.07,9.2 37.44,36.43 47.93,47.18 55.61,30.58 56.2,40.38 26.95,72.54 51.59,69.5 90.68,20.32 15.17,56.58 21.26,44.89 81.02,56.02 37.27,52
  pour Bottom (isolate 0.254): 6.86,76.2 6.86,63.5 0.25,63.5 0.25,12.95 6.86,12.95 6.86,0.25 95.76,0.25 95.76,12.95 98.81,12.95 98.81,63.5 95.76,63.5 95.76,76.2
  pour Top (isolate 0.254): 6.86,76.2 6.86,63.5 0.25,63.5 0.25,12.95 6.86,12.95 6.86,0.25 95.76,0.25 95.76,12.95 98.81,12.95 98.81,63.5 95.76,63.5 95.76,76.2
GNDI  (via drill 0.5)  (1 unrouted)
  other vias: 39.14,3.44 54.88,10.56
  pour Top (isolate 0.254): 34.04,16.76 64.01,16.76 64.01,0.25 34.54,0.25
  pour Bottom (isolate 0.254): 34.28,16.75 63.88,16.77 64.01,0.31 34.54,0.31
GPIO0
  Top 0.254: GPIO0.2 67.56,28.19 73.66,28.19 73.66,20.7 ESP-12.4
GPIO2  (2 unrouted)
GPIO12  (1 unrouted)
GPIO13  (1 unrouted)
GPIO14  (1 unrouted)
GPIO15  (3 unrouted)
  Top 0.254: 68.78,24.7 ESP-12.2
GPIO16  (2 unrouted)
IND
  Top 1.016: 5V_REG.2 49.63,68.04 | 49.63,68.04 I1.P$1 | 49.63,68.04 49.63,65.1 D2.P$1
INPUT-POS-A
  Top 0.254: R14.2 24.13,50.04
  Top 0.406: T1.2 9.46,50.07 C30.1 9.82,50.04 J2.1 J2.2 J2.3 24.13,50.04 33.69,50.04 33.82,49.91 SHUNTMON-A.1 33.02,48.86 C25.1
INPUT-POS-B  (1 unrouted)
  Top 0.254: R1.2 23.62,36.07 23.88,36.07
  Top 0.406: T2.2 9.65,36.1 | 9.65,36.07 C29.1 9.65,36.1 | J3.1 J3.2 J3.3 23.88,36.07 33.82,36.07 SHUNTMON-B.1 32.84,34.71 C6.1 | 12.19,36.1 9.65,36.1
LOAD-NEG-A
  Top 0.406: T1.1 9.46,53.57 C31.1 9.82,53.59 J1.1 J1.2 J1.3 33.82,53.59 SHUNTMON-A.8 33.02,54.78 C23.2
  Top 1.016: JP3.2 9.43,58.42 T1.1
LOAD-NEG-B  (1 unrouted)
  Top 0.254: J4.1 10.19,39.62 arc90 10.16,39.6
  Top 0.406: T2.1 10.16,39.6 12.19,39.6 | 9.65,39.62 C28.1 | J4.1 J4.2 J4.3 33.82,39.62 SHUNTMON-B.8 32.64,41.19 C24.2
  Top 1.016: T2.1 4.57,44.96 C-TANT.1
N$1
  Top 0.203: 78.23,42.77 U1_TQFP.7
  Top 0.254: U1_TQFP.7 78.23,42.79 75.82,40.39 65.02,40.39 65.02,38.1 Q1.2
  Top 0.406: C4.1 Q1.2
N$2
  Top 0.203: U1_TQFP.23 81.5,51.66 81.48,51.66
  Top 0.254: 82.35,55.59 R4.1 82.3,55.76 C5.2 82.32,52.66 81.5,51.73 U1_TQFP.23
N$4
  Top 0.254: SHUNTMON-A.5 35.77,54.86 R13.1
N$6
  Top 0.254: SHUNTMON-B.5 35.81,40.81 R5.1
N$9
  Top 0.203: 78.9,42.28 U1_TQFP.8
  Top 0.254: Q1.1 75.95,39.35 U1_TQFP.8
  Top 0.406: C11.1 74.64,37.88 Q1.1
N$11  (1 unrouted)
N$20
  Top 0.203: U1_TQFP.20 83.14,50 83.16,49.94
  Top 0.254: U1_TQFP.20 84.42,51.22 C8.1
N$24  (1 unrouted)
N$27
  Top 0.254: R16.1 78.07,55.96 C27.2 79.76,53.44 U1_TQFP.24
N$28  (via drill 0.5)
  Top 0.254: v35.05,56.64 35.05,53.97 SHUNTMON-A.6 SHUNTMON-A.7
  Bottom 0.254: REFERENCE_SELECT.2 43.18,56.64 v35.05,56.64
N$30  (via drill 0.5)
  Top 0.254: C21.2 90.77,14.48 v90.68,14.48
  Bottom 0.254: v90.68,14.48 72.64,14.48 FTDI1.1
N$36
  Top 0.254: FTDI1.3 77.72,11.43 66.55,11.43 66.55,17.95 R17.1
N$41
  Top 0.254: R10.1 84.42,40.11 LED1.A
POWERIN  (1 unrouted)
  Top 1.016: 44.27,66.33 5V_REG.1 43.5,66.33 C51.1 27.69,62.66 | 27.69,62.66 27.56,62.66 27.56,68.96 | JP3.1 24.64,59.62 27.69,62.66
REFINPUT  (via drill 0.5)
  Top 0.254: SHUNTMON-B.6 SHUNTMON-B.7 34.46,40 C12.1 R8.1 34.46,46.99 v40.64,46.99
  Bottom 0.254: v40.64,46.99 REFERENCE_SELECT.1
RES  (1 unrouted)
  Top 0.254: FTDI/UART.DTR 37.67,28.12 | MC32882.P$1 MC32882.P$2 28.25,18.29 41.91,18.29 | FTDI/UART.DTR 45.63,35.36 | FTDI/UART.DTR 38.43,22.52 C17.1
RESET  (via drill 0.5)
  Top 0.203: U1_TQFP.29 76.62,50 76.58,50.04
  Top 0.254: ISP.5 97.53,51.74 97.53,56.33 96.28,57.58 89.03,57.58 87.78,58.83 v87.53,59.09 87.35,59.27 R32.1 | U1_TQFP.29 75.38,51.18 v69.97,51.18 | C17.2 41.91,24.38 v47.75,24.38 | v57.15,36.07 59.54,38.46 v60.33,38.46
  Bottom 0.254: v60.33,38.46 60.33,41.43 70.08,51.18 v69.97,51.18 67.32,51.18 67.32,59.09 v87.53,59.09 | v47.75,24.38 53.09,24.38 53.09,32 v57.15,36.07
RESTESP
  Top 0.254: R19.1 89.07,14.64 C21.1 ESP-12.9

### Text on the board
tPlace: GND | RST | D3 | D11 | D13 | D4 | 3.3V | D12 | VSENSE-B | VSENSE-A
bPlace: emonDC | wireless energy monitoring node | Technology that helps us live within ecological limits | Designed in | Designed in North Wales UK by Megni | North Wales | Made in UK | Node: | OpenEnergyMonitor.org | Open-Hardware | Lead free PCB - RoHS components
tNames: D2 | 16MHz | FACTORY / RESET | GND / (0V) | RESET
tValues: B | A
tSilk: 5.0V | 4.7V | D9 | 2 / / 1 | D8 | RST | Rx | Tx | GND | UART / FTDI | RST | Rx | Tx | 5V | GND | emonDC | Wireless Energy / Monitoring Node | v0.3 Dec 2016 by DB | based on emonTx / v3.4 by GH and TL | RST | Rx | Tx | 5V | GND | ISOLATED UART / FTDI
_tsilk: Designed in | North Wales | Made in UK
_bsilk: SMT V0.6 rev3 | emonTx | wireless energy monitoring node | SMT V0.6 rev3 | emonTx | SMT V0.6 rev3 | emonTx | Technology that helps us live within ecological limits | wireless energy monitoring node | wireless energy monitoring node | Designed in North Wales UK by Glyn Hudson & Trystan Lea | Technology that helps us live within ecological limits | Technology that helps us live within ecological limits | Designed in North Wales UK by Glyn Hudson & Trystan Lea | 165mm ant | 433Mhz | Designed in North Wales UK by Glyn Hudson & Trystan Lea | 165mm ant | 165mm ant | 433Mhz | 433Mhz | 868Mhz | 82mm ant | 82mm ant | 82mm ant | 868Mhz | 868Mhz | 78mm ant | 915Mhz | 78mm ant | 915Mhz | 78mm ant | 915Mhz | 165mm ant | 433Mhz | 82mm ant | 868Mhz | 78mm ant | 915Mhz